# EAGLE design garbage2_routed (EAGLE 5.06)
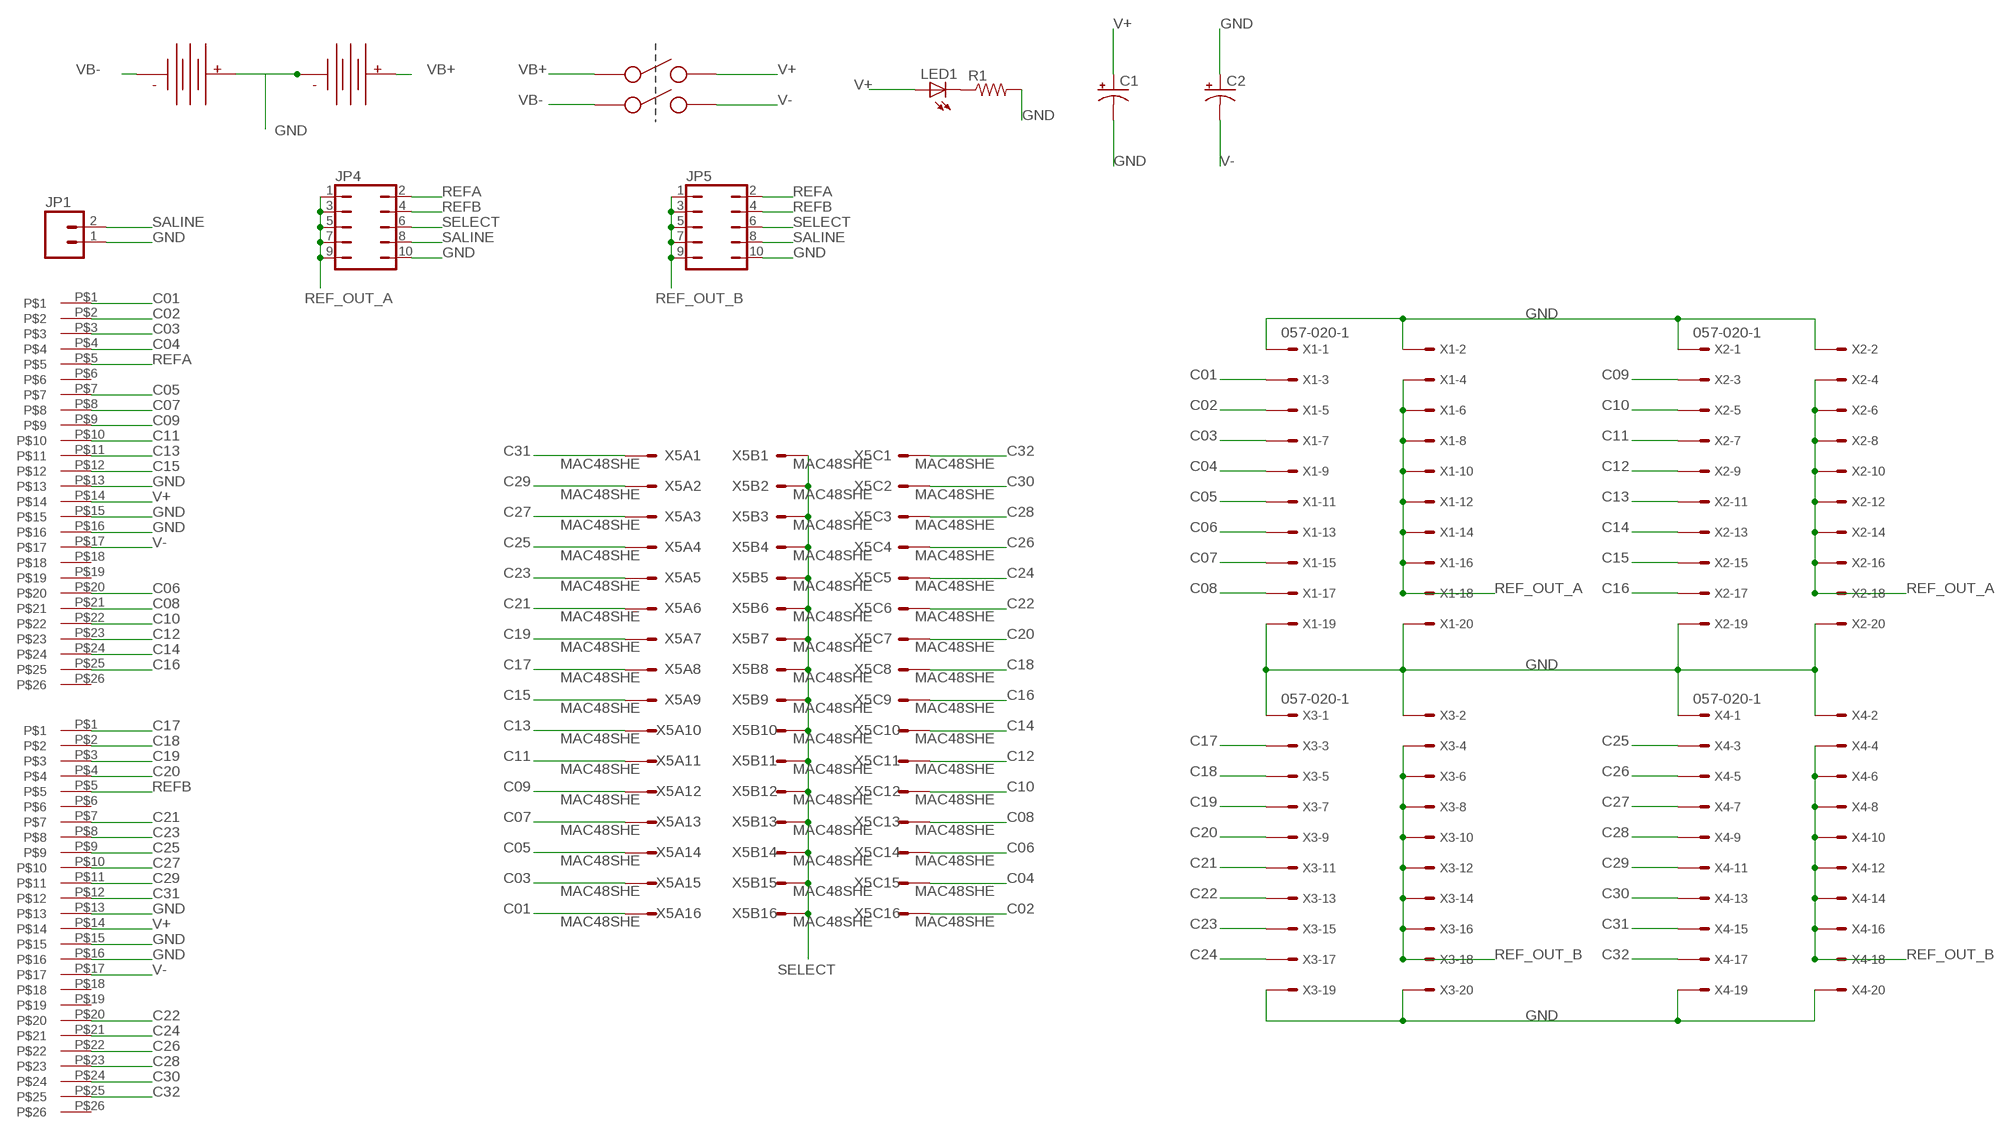
[diagram p0: schematic, sheet 1]

## Parts
BANKA  MINI-DB26TYCO1761028-1  [MINI-DB26]
C1  CPOL-USE2.5-6  [E2,5-6]
C2  CPOL-USE2.5-6  [E2,5-6]
JP1  M02LOCK  [1X02_LOCK]
JP4  JP5Q  [JP5Q]
JP5  JP5Q  [JP5Q]
LED1  LED5MM  [LED5MM]
R1  R-US_0207/10  [0207/10]
U$1  AA-BAT-BHAA-3BHAA-3  [AA-BAT-BHAA-3]
U$2  AA-BAT-BHAA-3BHAA-3  [AA-BAT-BHAA-3]
U$3  MINI-DB26TYCO1761028-1  [MINI-DB26]
U$5  SWITCH-DPST-S201031MS02QDPST  [SWITCH-DPST-S201031MS02Q]
X1  057-020-1  [057-020-1]
X2  057-020-1  [057-020-1]
X3  057-020-1  [057-020-1]
X4  057-020-1  [057-020-1]
X5  MAC48SHE  [MAC48SH]

## Nets
C01: BANKA.P$1 X1.3 X5.A16
C02: BANKA.P$2 X1.5 X5.C16
C03: BANKA.P$3 X1.7 X5.A15
C04: BANKA.P$4 X1.9 X5.C15
C05: BANKA.P$7 X1.11 X5.A14
C06: BANKA.P$20 X1.13 X5.C14
C07: BANKA.P$8 X1.15 X5.A13
C08: BANKA.P$21 X1.17 X5.C13
C09: BANKA.P$9 X2.3 X5.A12
C10: BANKA.P$22 X2.5 X5.C12
C11: BANKA.P$10 X2.7 X5.A11
C12: BANKA.P$23 X2.9 X5.C11
C13: BANKA.P$11 X2.11 X5.A10
C14: BANKA.P$24 X2.13 X5.C10
C15: BANKA.P$12 X2.15 X5.A9
C16: BANKA.P$25 X2.17 X5.C9
C17: U$3.P$1 X3.3 X5.A8
C18: U$3.P$2 X3.5 X5.C8
C19: U$3.P$3 X3.7 X5.A7
C20: U$3.P$4 X3.9 X5.C7
C21: U$3.P$7 X3.11 X5.A6
C22: U$3.P$20 X3.13 X5.C6
C23: U$3.P$8 X3.15 X5.A5
C24: U$3.P$21 X3.17 X5.C5
C25: U$3.P$9 X4.3 X5.A4
C26: U$3.P$22 X4.5 X5.C4
C27: U$3.P$10 X4.7 X5.A3
C28: U$3.P$23 X4.9 X5.C3
C29: U$3.P$11 X4.11 X5.A2
C30: U$3.P$24 X4.13 X5.C2
C31: U$3.P$12 X4.15 X5.A1
C32: U$3.P$25 X4.17 X5.C1
GND: BANKA.P$13 BANKA.P$15 BANKA.P$16 C1.- C2.+ JP1.1 JP4.10 JP5.10 R1.2 U$1.POS U$2.NEG U$3.P$13 U$3.P$15 U$3.P$16 X1.1 X1.2 X1.19 X1.20 X2.1 X2.2 X2.19 X2.20 X3.1 X3.2 X3.19 X3.20 X4.1 X4.2 X4.19 X4.20
N$1: LED1.K(C) R1.1
REF_OUT_A: JP4.1 JP4.3 JP4.5 JP4.7 JP4.9 X1.4 X1.6 X1.8 X1.10 X1.12 X1.14 X1.16 X1.18 X2.4 X2.6 X2.8 X2.10 X2.12 X2.14 X2.16 X2.18
REF_OUT_B: JP5.1 JP5.3 JP5.5 JP5.7 JP5.9 X3.4 X3.6 X3.8 X3.10 X3.12 X3.14 X3.16 X3.18 X4.4 X4.6 X4.8 X4.10 X4.12 X4.14 X4.16 X4.18
REFA: BANKA.P$5 JP4.2 JP5.2
REFB: JP4.4 JP5.4 U$3.P$5
SALINE: JP1.2 JP4.8 JP5.8
SELECT: JP4.6 JP5.6 X5.B1 X5.B2 X5.B3 X5.B4 X5.B5 X5.B6 X5.B7 X5.B8 X5.B9 X5.B10 X5.B11 X5.B12 X5.B13 X5.B14 X5.B15 X5.B16
V+: BANKA.P$14 C1.+ LED1.A U$3.P$14 U$5.PIN2
V-: BANKA.P$17 C2.- U$3.P$17 U$5.PIN5
VB+: U$2.POS U$5.PIN1
VB-: U$1.NEG U$5.PIN4
Unconnected: BANKA.P$6 BANKA.P$18 BANKA.P$19 BANKA.P$26 U$3.P$6 U$3.P$18 U$3.P$19 U$3.P$26

## Library data of the parts
BANKA U$3 = coxlab:MINI-DB26
C1 C2 = resistor:CPOL-US: POLARIZED CAPACITOR, American symbol
JP1 = SparkFun:M02: Header 2 Standard 2-pin 0.1" header. Use with straight break away headers (SKU : PRT-00116), right angle break away headers (PRT-00553), swiss pins (PRT-00743), machine pins (PRT-00117), and female headers (PRT-00115). Molex polarized connector foot print use with SKU : PRT-08233 with associated crimp pins and housings.
JP4 JP5 = jumper:JP5Q: JUMPER
LED1 = led:LED: LED OSRAM: - CHIPLED LG R971, LG N971, LY N971, LG Q971, LY Q971, LO R971, LY R971 LH N974, LH R974 LS Q976, LO Q976, LY Q976 LO Q996 - Hyper CHIPLED LW Q18S LB Q993, LB Q99A, LB R99A - SideLED LS A670, LO A670, LY A670, LG A670, LP A670 LB A673, LV A673, LT A673, LW A673 LH A674 LY A675 LS A676, LA A676, LO A676, LY A676, LW A676 LS A679, LY A679, LG A679 - Hyper Micro SIDELED® LS Y876, LA Y876, LO Y876, LY Y876 LT Y87S - SmartLED LW L88C, LW L88S LB L89C, LB L89S, LG L890 LS L89K, LO L89K, LY L89K LS L896, LA L896, LO L896, LY L896 - TOPLED LS T670, LO T670, LY T670, LG T670, LP T670 LSG T670, LSP T670, LSY T670, LOP T670, LYG T670 LG T671, LOG T671, LSG T671 LB T673, LV T673, LT T673, LW T673 LH T674 LS T676, LA T676, LO T676, LY T676, LB T676, LH T676, LSB T676, LW T676 LB T67C, LV T67C, LT T67C, LS T67K, LO T67K, LY T67K, LW E67C LS E67B, LA E67B, LO E67B, LY E67B, LB E67C, LV E67C, LT E67C LW T67C LS T679, LY T679, LG T679 LS T770, LO T770, LY T770, LG T770, LP T770 LB T773, LV T773, LT T773, LW T773 LH T774 LS E675, LA E675, LY E675, LS T675 LS T776, LA T776, LO T776, LY T776, LB T776 LHGB T686 LT T68C, LB T68C - Hyper Mini TOPLED® LB M676 - Mini TOPLED Santana® LG M470 LS M47K, LO M47K, LY M47K Source: http://www.osram.convergy.de LUXEON: - LUMILED® LXK2-PW12-R00, LXK2-PW12-S00, LXK2-PW14-U00, LXK2-PW14-V00 LXK2-PM12-R00, LXK2-PM12-S00, LXK2-PM14-U00 LXK2-PE12-Q00, LXK2-PE12-R00, LXK2-PE12-S00, LXK2-PE14-T00, LXK2-PE14-U00 LXK2-PB12-K00, LXK2-PB12-L00, LXK2-PB12-M00, LXK2-PB14-N00, LXK2-PB14-P00, LXK2-PB14-Q00 LXK2-PR12-L00, LXK2-PR12-M00, LXK2-PR14-Q00, LXK2-PR14-R00 LXK2-PD12-Q00, LXK2-PD12-R00, LXK2-PD12-S00 LXK2-PH12-R00, LXK2-PH12-S00 LXK2-PL12-P00, LXK2-PL12-Q00, LXK2-PL12-R00 Source: www.luxeon.com KINGBRIGHT: KA-3528ASYC Source: www.kingbright.com
R1 = resistor:R-US_: RESISTOR, American symbol
U$1 U$2 = coxlab:AA-BAT-BHAA-3: PCB mount AA battery holder
U$5 = coxlab:SWITCH-DPST-S201031MS02Q
X1-X4 = con-panduit:057-020-: CONNECTOR 20-pin series 057 contact pc board low profile headers
X5 = con-vg:MAC48SHE: CONNECTOR male, 48 pins, single, type C/2, rows ABC, grid 2.54 mm

## Board
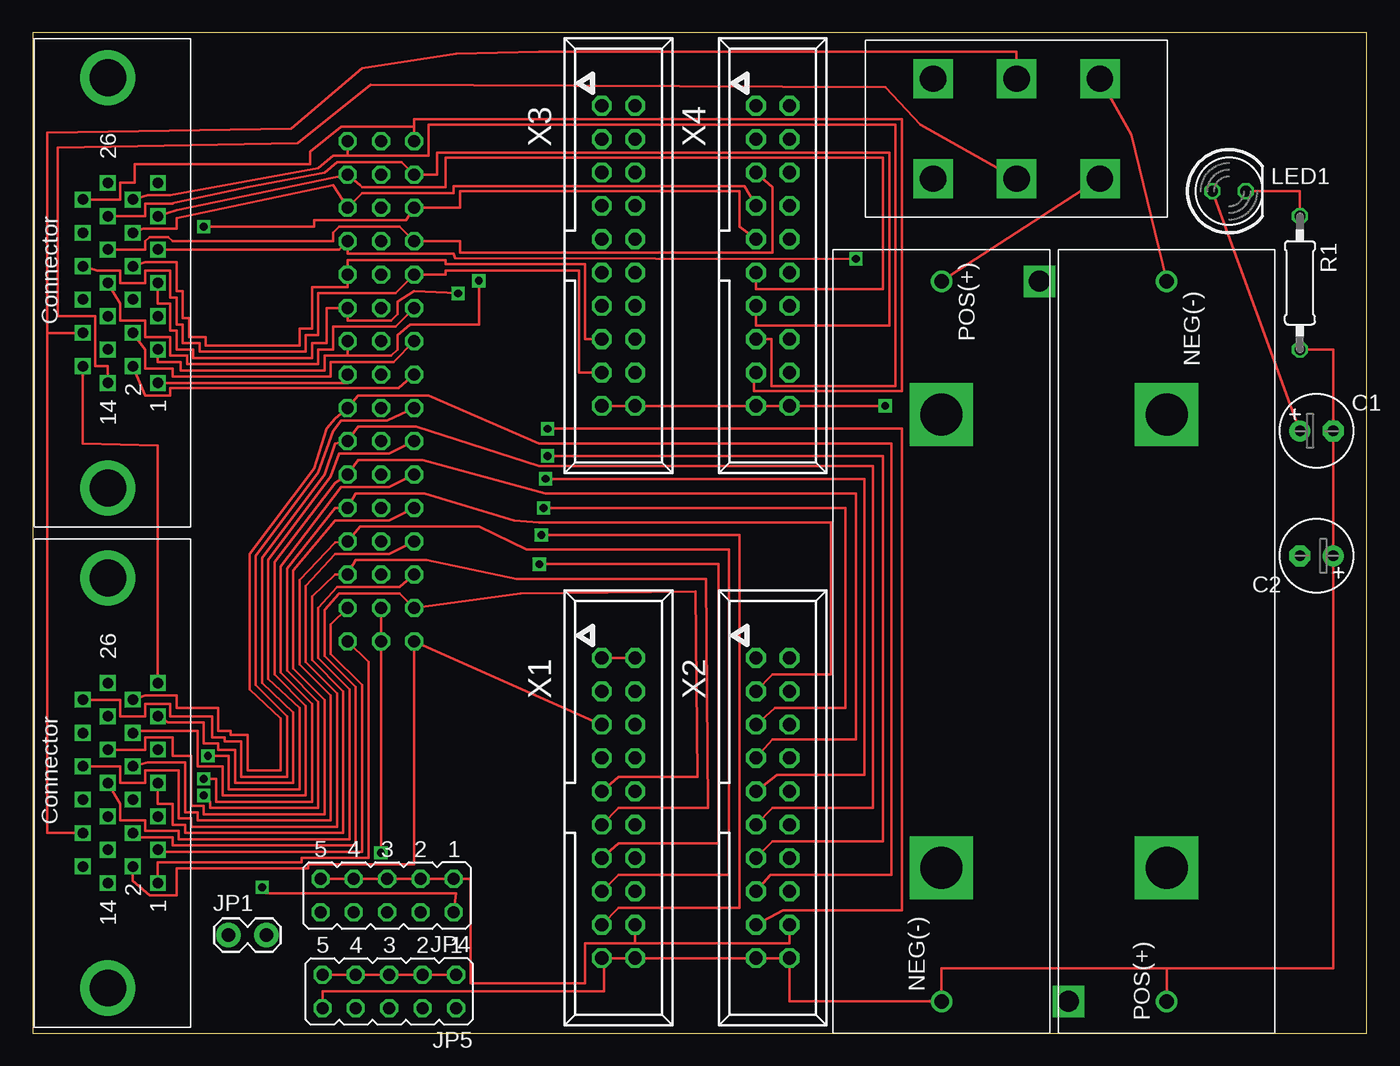
[diagram p1: board, top side]
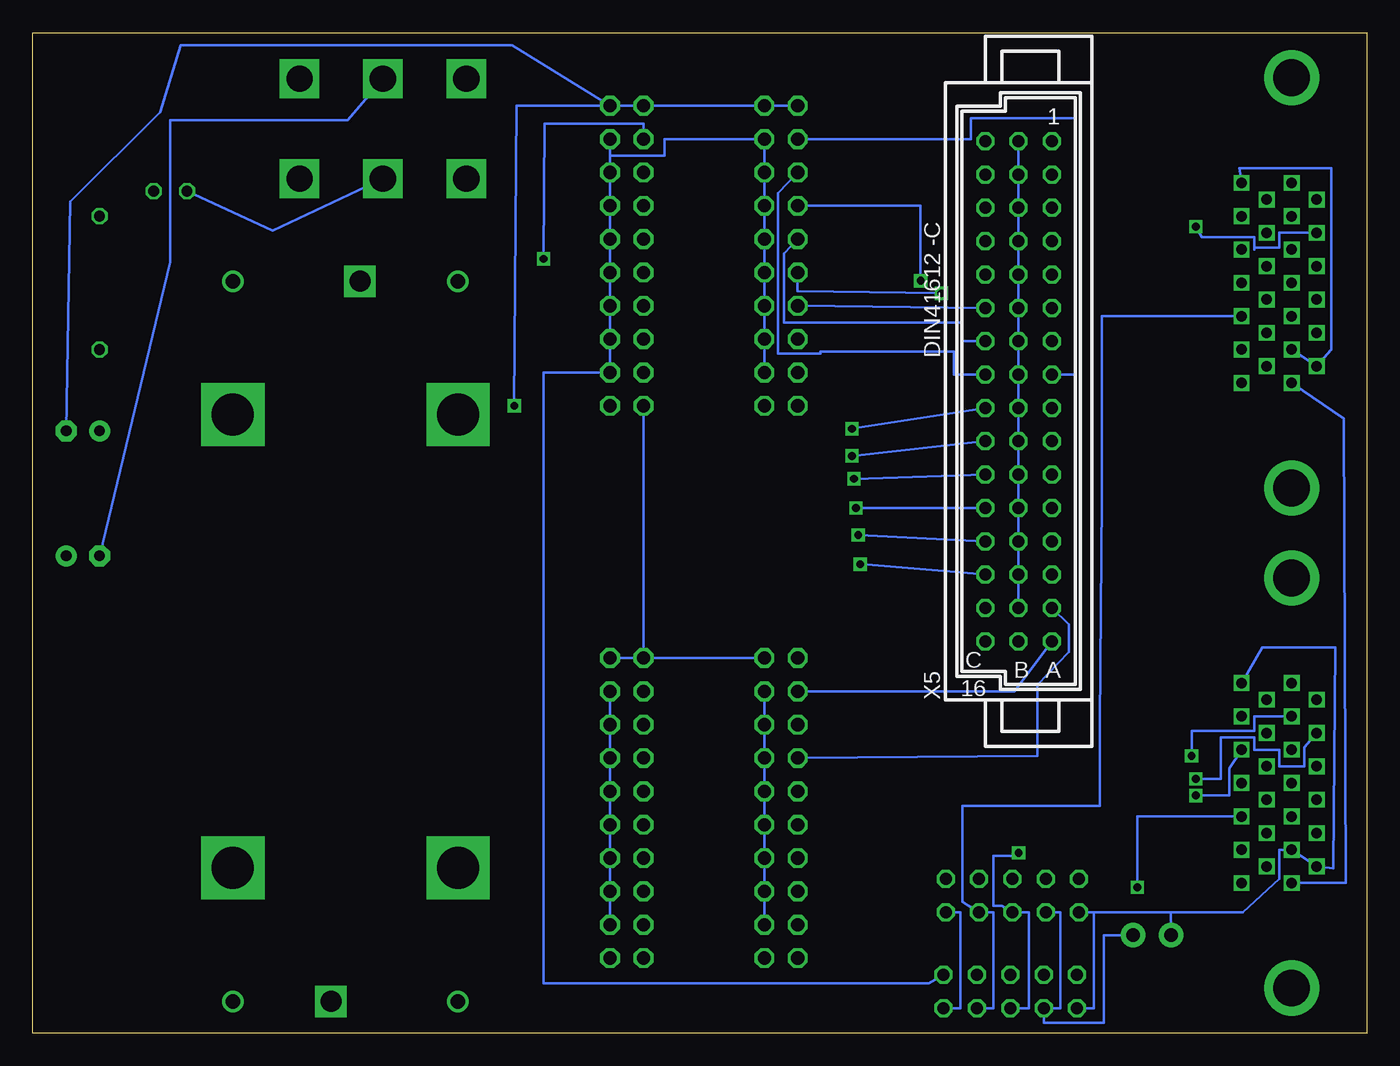
[diagram p2: board, bottom side, seen from below]

Size 101.6 x 76.2 mm. Coordinates in mm from the lower left corner, seen from the top.
Outline: 0,0 101.6,0 101.6,76.2 0,76.2 0,0
Copper layers (1*16): Top 0.0178mm / dielectric 1.4986mm / Bottom 0.0178mm
Design rules "SSC-EAGLE-2Lyr_v1.0.0.3": minimum track width 6mil, minimum drill 14mil, track to track 6mil, track to pad 6mil, pad to pad 6mil, via to via 6mil, smd to smd 6mil, copper to edge 20mil, drill to drill 16mil, minimum pad ring 8mil, minimum via ring 8mil, stop-mask expansion 3mil, vias tented up to drill 0mil, thermal gap 10mil

### Footprints (pad centres in the part's own frame; a part is rotated, then mirrored left to right if it is on the bottom)
MINI-DB26 = drill 0.8 square: P$1 7.62,3.81; P$2 6.35,1.905; P$3 5.08,3.81; P$4 3.81,1.905; P$5 2.54,3.81; P$6 1.27,1.905; P$7 0,3.81; P$8 -1.27,1.905; P$9 -2.54,3.81; P$10 -3.81,1.905; P$11 -5.08,3.81; P$12 -6.35,1.905; P$13 -7.62,3.81; P$14 7.62,0; P$15 6.35,-1.905; P$16 5.08,0; P$17 3.81,-1.905; P$18 2.54,0; P$19 1.27,-1.905; P$20 0,0; P$21 -1.27,-1.905; P$22 -2.54,0; P$23 -3.81,-1.905; P$24 -5.08,0; P$25 -6.35,-1.905; P$26 -7.62,0 | drill 2.8 round: P$27 15.621,0; P$28 -15.621,0
E2,5-6 = drill 0.813 pad 1.6 round: + -1.27,0 | drill 0.813 pad 1.6 octagon: - 1.27,0
1X02_LOCK = drill 1.016 pad 1.88 round: 1 -0.178,0; 2 2.718,0
JP5Q = drill 0.914 octagon: 1 -5.08,-1.27; 2 -5.08,1.27; 3 -2.54,-1.27; 4 -2.54,1.27; 5 0,-1.27; 6 0,1.27; 7 2.54,-1.27; 8 2.54,1.27; 9 5.08,-1.27; 10 5.08,1.27
LED5MM = drill 0.813 octagon: A -1.27,0; K 1.27,0
0207/10 = drill 0.813 octagon: 1 -5.08,0; 2 5.08,0
AA-BAT-BHAA-3 = drill 1.1 round: NEG -27.432,0; POS 27.432,0 | drill 1.6 square: P$3 27.432,-7.468 | drill 3.2 square: P$4 17.272,0; P$5 -17.272,0
SWITCH-DPST-S201031MS02Q = drill 2 square: PIN1 3.81,6.35; PIN2 3.81,0; PIN3 3.81,-6.35; PIN4 -3.81,6.35; PIN5 -3.81,0; PIN6 -3.81,-6.35
057-020-1 = drill 1 octagon: 1 -11.43,-1.27; 2 -11.43,1.27; 3 -8.89,-1.27; 4 -8.89,1.27; 5 -6.35,-1.27; 6 -6.35,1.27; 7 -3.81,-1.27; 8 -3.81,1.27; 9 -1.27,-1.27; 10 -1.27,1.27; 11 1.27,-1.27; 12 1.27,1.27; 13 3.81,-1.27; 14 3.81,1.27; 15 6.35,-1.27; 16 6.35,1.27; 17 8.89,-1.27; 18 8.89,1.27; 19 11.43,-1.27; 20 11.43,1.27
MAC48SH = drill 0.914 octagon: A1 2.54,19.05; A2 2.54,16.51; A3 2.54,13.97; A4 2.54,11.43; A5 2.54,8.89; A6 2.54,6.35; A7 2.54,3.81; A8 2.54,1.27; A9 2.54,-1.27; A10 2.54,-3.81; A11 2.54,-6.35; A12 2.54,-8.89; A13 2.54,-11.43; A14 2.54,-13.97; A15 2.54,-16.51; A16 2.54,-19.05; B1 0,19.05; B2 0,16.51; B3 0,13.97; B4 0,11.43; B5 0,8.89; B6 0,6.35; B7 0,3.81; B8 0,1.27; B9 0,-1.27; B10 0,-3.81; B11 0,-6.35; B12 0,-8.89; B13 0,-11.43; B14 0,-13.97; B15 0,-16.51; B16 0,-19.05; C1 -2.54,19.05; C2 -2.54,16.51; C3 -2.54,13.97; C4 -2.54,11.43; C5 -2.54,8.89; C6 -2.54,6.35; C7 -2.54,3.81; C8 -2.54,1.27; C9 -2.54,-1.27; C10 -2.54,-3.81; C11 -2.54,-6.35; C12 -2.54,-8.89; C13 -2.54,-11.43; C14 -2.54,-13.97; C15 -2.54,-16.51; C16 -2.54,-19.05

### Placement (x,y rotation side)
BANKA  5.71,19.05 270 top
C1  97.79,45.88 0 top
C2  97.79,36.35 180 top
JP1  15.08,7.46 0 top
JP4  26.99,10.48 180 top
JP5  27.15,3.17 180 top
LED1  91.12,64.14 0 top
R1  96.52,57.15 270 top
U$1  86.36,29.84 270 top
U$2  69.22,29.84 90 top
U$3  5.71,57.15 270 top
U$5  74.93,68.9 270 top
X1  44.61,17.14 270 top
X2  56.36,17.14 270 top
X3  44.61,59.21 270 top
X4  56.36,59.21 270 top
X5  26.51,48.9 0 bottom

### Tracks (layer width: path | path; a pad name or v marks a point on that pad's centre or on a via)
C01
  Top 0.203: BANKA.P$1 9.53,13.02 20.48,13.02 20.48,13.34 25.56,13.34 25.56,28.26 X5.A16
  Bottom 0.203: X1.3 26.83,26.04 X5.A16
C02
  Top 0.203: BANKA.P$2 7.62,11.59 8.89,10.48 10.95,10.48 10.95,12.54 20.95,12.54 20.95,12.86 29.05,12.86 X5.C16 X1.5
C03
  Top 0.203: 25.08,13.97 25.08,14.29 | 25.08,13.97 25.08,26.51 22.7,28.89 22.7,31.11 X5.A15 | 25.08,13.97 25.08,13.81 9.53,13.81 BANKA.P$3
  Bottom 0.203: X5.A15 22.7,31.11 22.7,29.05 25.08,26.51 25.08,21.11 X1.7
C04
  Top 0.203: X5.C15 27.94,33.5 23.34,33.5 22.23,32.23 22.23,28.73 24.61,26.35 24.61,14.29 10.64,14.29 10.64,14.92 8.26,14.92 BANKA.P$4 | X5.C15 | X1.9 44.61,19.53 50.64,19.53 50.48,33.66 37.15,33.5 X5.C15
C05
  Top 0.203: BANKA.P$7 9.53,17.46 10.64,17.46 10.64,15.88 11.59,15.88 11.59,15.24 23.65,15.24 23.65,26.04 21.27,28.42 21.27,33.26 23.02,34.92 X5.A14 24.61,36.04 30,36.04 36.83,34.61 51.28,34.61 51.44,17.14 44.61,17.14 X1.11
C06  (via drill 0.6)
  Top 0.203: X5.C14 27.94,33.97 23.18,33.97 21.75,32.38 21.75,28.57 24.13,26.19 24.13,14.76 11.11,14.76 11.11,15.4 8.57,15.4 8.57,16.19 6.67,16.19 6.67,17.46 BANKA.P$20 | X1.13 44.61,14.45 52.23,14.45 52.23,35.72 v38.58,35.72
  Bottom 0.203: v38.58,35.72 X5.C14
C07
  Top 0.203: 23.02,37.39 | BANKA.P$8 8.73,20.64 11.59,20.64 11.59,16.83 12.54,16.83 12.54,16.19 22.7,16.19 22.7,25.72 20.32,28.1 20.32,34.53 23.02,37.39 | 23.02,37.39 X5.A13 24.92,38.58 33.97,38.58 37.62,36.83 53.02,36.83 53.02,12.06 44.61,12.06 X1.15
C08  (via drill 0.6)
  Top 0.203: BANKA.P$21 6.67,20.32 6.67,19.05 8.57,19.05 8.57,20 11.11,20 11.11,16.35 12.06,16.35 12.06,15.72 23.18,15.72 23.18,25.88 20.8,28.26 20.8,34.05 23.02,36.51 27.15,36.51 X5.C13 | X1.17 44.61,9.53 53.82,9.53 53.82,37.94 v38.73,37.94
  Bottom 0.203: v38.73,37.94 X5.C13
C09  (via drill 0.6 pad 0.25)
  Top 0.203: v13.02,18.1 13.49,17.62 13.49,17.14 21.75,17.14 21.75,25.24 19.37,27.62 19.37,35.4 23.02,40.01 X5.A12 24.61,41.12 29.84,41.12 36.67,39.05 38.58,38.89 60.8,38.89 60.8,27.3 56.36,27.3 X2.3
  Bottom 0.203: v13.02,18.1 10.48,18.1 10.48,20.16 BANKA.P$9
C10  (via drill 0.6)
  Top 0.203: BANKA.P$22 8.57,21.59 8.57,22.54 10.64,22.54 10.64,21.11 12.06,21.11 12.06,17.3 13.02,17.3 13.02,16.67 22.23,16.67 22.23,25.4 19.84,27.78 19.84,35.24 23.02,39.05 27.15,39.05 X5.C12 | X2.5 56.52,24.77 61.91,24.77 61.91,40.01 v38.89,40.01
  Bottom 0.203: v38.89,40.01 X5.C12
C11
  Top 0.203: BANKA.P$10 8.1,23.02 12.54,23.02 12.54,20.32 14.45,20.32 14.45,18.1 20.8,18.1 20.8,24.92 18.41,27.3 18.41,35.88 23.02,41.91 X5.A11 24.77,43.66 29.69,43.66 39.05,41.12 62.71,41.12 62.71,22.38 56.36,22.38 X2.7
C12  (via drill 0.6, 0.6 pad 0.25)
  Top 0.203: v13.02,19.37 13.97,19.37 13.97,17.62 21.27,17.62 21.27,25.08 18.89,27.46 18.89,35.56 23.5,41.59 27.15,41.59 X5.C11 | X2.9 56.67,19.68 63.34,19.68 63.34,42.23 v39.05,42.23
  Bottom 0.203: v13.02,19.37 11.11,19.37 11.11,22.54 8.57,22.54 8.57,21.59 6.67,21.59 6.67,20.32 4.76,20.32 4.76,21.75 BANKA.P$23 | v39.05,42.23 X5.C11
C13
  Top 0.203: BANKA.P$11 10.32,23.65 13.02,23.65 13.02,22.07 14.13,22.07 14.13,21.59 15.4,21.59 15.4,19.05 19.84,19.05 19.84,24.45 17.46,26.67 17.46,36.2 22.23,42.55 23.02,44.93 X5.A10 24.77,46.2 29.21,46.2 38.58,43.18 63.98,43.18 63.98,17.14 56.36,17.14 X2.11
C14  (via drill 0.6, 0.6 pad 0.25)
  Top 0.203: v13.34,21.11 14.92,21.11 14.92,18.57 20.32,18.57 20.32,24.77 17.94,26.99 17.94,36.04 22.7,42.39 23.34,44.13 27.15,44.13 X5.C10 | X2.13 56.36,14.61 64.77,14.61 64.77,43.97 v39.21,43.97
  Bottom 0.203: v13.34,21.11 13.34,23.02 8.57,23.02 8.57,24.13 BANKA.P$24 | X5.C10 v39.21,43.97
C15
  Top 0.203: BANKA.P$12 8.57,25.72 10.95,25.72 10.95,24.77 14.13,24.77 14.13,23.02 15.08,23.02 15.08,22.7 16.35,22.7 16.35,20 18.89,20 18.89,23.97 16.51,26.19 16.51,36.51 21.43,43.02 22.38,46.04 23.02,46.83 X5.A9 24.77,48.58 30.16,48.58 38.58,44.93 65.41,44.93 65.41,12.06 56.2,12.06 X2.15
C16  (via drill 0.6)
  Top 0.203: 22.86,45.88 | BANKA.P$25 6.67,25.4 6.67,24.13 8.57,24.13 8.57,25.08 10.48,25.08 10.48,24.13 13.65,24.13 13.65,22.54 14.61,22.54 14.61,22.23 15.88,22.23 15.88,19.53 19.37,19.53 19.37,24.13 16.99,26.51 16.99,36.35 21.75,42.7 22.86,45.88 | X5.C9 26.99,46.67 23.5,46.67 22.86,45.88 | X2.17 57.15,9.37 66.2,9.37 66.2,46.04 v39.21,46.04
  Bottom 0.203: X5.C9 v39.21,46.04
C17
  Top 0.203: U$3.P$1 23.97,49.53 X5.A8
  Bottom 0.203: X3.3 30.16,68.1 30.16,69.69 22.23,69.69 22.23,50.16 X5.A8
C18
  Top 0.203: X5.C8 27.86,49.13 10.48,49.13 10.48,48.58 8.57,48.58 U$3.P$2
  Bottom 0.203: X5.C8 31.43,50.16 31.43,51.91 41.59,51.91 41.59,51.75 44.85,51.75 44.85,63.98 X3.5
C19  (via drill 0.6)
  Top 0.203: 23.97,51.59 22.23,51.59 22.23,50.48 11.27,50.48 11.27,51.12 9.53,51.12 U$3.P$3 | 23.97,51.59 X5.A7 | 23.97,51.59 27.3,51.59 27.78,52.07 27.78,53.18 28.73,53.98 33.97,53.98 v33.97,57.31
  Bottom 0.203: v33.97,57.31 33.97,63.02 X3.7
C20
  Top 0.203: X5.C7 27.46,51.12 22.7,51.12 22.7,50.01 10.64,50.01 10.64,50.64 8.57,50.64 8.57,52.07 U$3.P$4
  Bottom 0.203: X5.C7 30.8,52.7 30.8,54.13 42.39,54.13 42.7,54.13 44.37,54.13 44.37,59.37 X3.9
C21  (via drill 0.6)
  Top 0.203: U$3.P$7 9.53,55.56 10.48,55.56 10.48,53.5 10.95,53.5 10.95,52.07 12.22,52.07 12.22,51.44 21.27,51.44 21.27,52.55 22.38,52.55 22.38,55.24 X5.A6 23.97,54.29 27.3,54.29 27.78,54.77 27.78,55.72 29.05,56.52 v32.38,56.36
  Bottom 0.203: v32.38,56.36 43.34,56.52 X3.11
C22
  Top 0.203: X5.C6 27.62,53.82 22.86,53.82 22.86,52.07 21.75,52.07 21.75,50.96 11.75,50.96 11.75,51.59 10.48,51.59 10.48,53.02 8.57,53.02 8.57,54.29 6.67,54.29 6.67,55.56 U$3.P$20
  Bottom 0.203: X5.C6 X3.13
C23
  Top 0.203: U$3.P$8 8.57,58.74 10.95,58.74 10.95,56.52 11.43,56.52 11.43,54.45 11.91,54.45 11.91,53.02 13.18,53.02 13.18,52.39 20.32,52.39 20.32,53.66 21.27,53.66 21.27,56.83 23.97,56.83 X5.A5 23.97,58.9 31.43,58.9 31.43,58.58 42.07,58.58 42.07,52.86 X3.15
C24
  Top 0.203: U$3.P$21 4.92,58.1 6.67,58.1 6.67,57.15 8.57,57.15 8.57,58.1 10.48,58.1 10.48,56.04 10.95,56.04 10.95,53.98 11.43,53.98 11.43,52.55 12.7,52.55 12.7,51.91 20.8,51.91 20.8,53.18 21.75,53.18 21.75,56.36 27.62,56.36 X5.C5 31.43,57.78 31.43,58.1 41.59,58.1 41.59,50.32 X3.17
C25  (via drill 0.6)
  Top 0.203: U$3.P$9 23.34,59.69 X5.A4 23.97,59.37 32.07,59.37 32.15,59.05 v62.71,58.98
  Bottom 0.203: v62.71,58.98 62.63,69.29 55.09,69.29 X4.3
C26
  Top 0.203: U$3.P$22 8.57,59.69 8.57,60.33 8.89,60.64 10.32,60.64 10.64,60.33 22.86,60.33 22.86,60.96 23.34,61.44 27.94,61.44 X5.C4 32.54,60.33 32.54,59.45 56.36,59.45 56.36,64.45 X4.5
C27
  Top 0.203: U$3.P$10 8.41,61.28 10.95,61.28 10.95,62.07 22.86,64.61 X5.A3 25.08,63.98 32.07,63.98 32.07,64.53 54.21,64.53 X4.7
C28  (via drill 0.6)
  Top 0.203: v13.02,61.44 21.43,61.44 21.43,61.91 28.42,61.91 X5.C3 32.54,62.87 32.54,64.14 53.82,64.14 53.82,61.44 X4.9
  Bottom 0.203: U$3.P$23 6.67,60.96 6.67,59.85 8.57,59.85 | 8.57,59.85 8.57,59.69 | 8.57,59.85 8.57,60.64 12.54,60.64 v13.02,61.44
C29
  Top 0.203: U$3.P$11 10.95,62.71 X5.A2 24.92,64.61 25.08,64.45 31.43,64.45 31.43,66.67 64.77,66.67 64.77,56.67 55.09,56.67 X4.11
C30
  Top 0.203: 10.48,63.18 16.35,64.45 22.23,65.56 23.18,66.36 28.1,66.36 X5.C2 30.8,65.41 30.8,67.07 65.25,67.07 65.25,53.9 55.09,53.9 X4.13 | 10.48,63.18 8.57,63.18 8.57,62.23 U$3.P$24 | 10.48,63.18 10.64,63.18
C31
  Top 0.203: 23.97,66.83 X5.A1 23.97,66.83 | 23.97,66.83 22.86,66.83 21.75,65.88 10.48,63.82 8.73,63.82 U$3.P$12 | 23.97,66.83 30.16,66.83 30.16,69.22 65.72,69.22 65.72,49.29 56.28,49.29 56.28,52.86 X4.15
C32
  Top 0.203: U$3.P$25 6.67,63.5 6.67,64.77 7.78,64.77 7.78,66.2 21.11,66.2 21.11,67.15 23.5,69.06 29.05,69.06 X5.C1 29.05,69.61 66.2,69.61 66.2,48.9 54.93,48.9 54.93,50.32 X4.17
GND  (via drill 0.6)
  Top 0.203: JP5.10 22.07,3.17 43.5,3.17 43.5,5.71 X1.19 X1.20 X2.19 X2.20 57.63,2.41 U$2.NEG 69.22,4.92 86.36,4.92 | 86.36,4.92 U$1.POS | 86.36,4.92 99.06,4.92 C2.+ C1.- 99.06,52.07 R1.2 | X3.19 X3.20 X4.19 X4.20 v64.93,47.78 | X1.2 X1.1 | U$3.P$15 3.81,44.93 9.53,44.77 BANKA.P$13
  Bottom 0.203: 20.8,9.21 JP4.10 | 20.8,9.21 20.8,1.91 JP5.10 | JP5.10 | 14.9,9.21 JP1.1 | 14.9,9.21 20.8,9.21 | 14.9,9.21 9.45,9.21 6.67,11.75 6.67,13.97 BANKA.P$16 BANKA.P$15 2.54,12.54 2.38,29.37 7.94,29.37 BANKA.P$13 | X4.2 65.09,75.25 90.33,75.25 91.92,70.17 98.74,63.34 C1.- | X4.2 X4.1 X3.2 X3.1 | v64.93,47.78 64.77,70.64 X4.2 | X2.1 X2.2 | X4.19 X2.1 | X2.1 X1.2 | U$3.P$16 U$3.P$15 2.7,52.07 2.7,65.88 9.68,65.88 U$3.P$13
N$1
  Top 0.203: R1.1 96.52,64.14 LED1.K
REF_OUT_A
  Top 0.203: JP4.9 JP4.7 JP4.5 JP4.3 JP4.1 33.34,11.75 33.34,3.81 42.07,3.81 42.07,6.83 45.88,6.83 | 45.88,6.83 X1.18 | X2.18 57.63,6.83 45.88,6.83
  Bottom 0.203: X2.4 X2.6 X2.8 X2.10 X2.12 X2.14 X2.16 X2.18 | X1.4 X1.6 X1.8 X1.10 X1.12 X1.14 X1.16 X1.18
REF_OUT_B
  Top 0.203: JP5.9 JP5.7 25.24,4.45 JP5.5 JP5.3 JP5.1
  Bottom 0.203: JP5.1 33.34,3.81 62.71,3.81 62.71,50.32 X4.18 X4.16 X4.14 X4.12 X4.10 X4.8 X4.6 57.63,66.83 | 57.63,66.83 X4.4 | 57.63,66.83 53.5,66.83 53.5,68.1 X3.4 X3.6 X3.8 X3.10 X3.12 X3.14 X3.16 X3.18
REFA  (via drill 0.6)
  Top 0.203: v17.46,11.11 17.78,10.64 32.23,10.64 JP4.2
  Bottom 0.203: JP4.2 30.96,9.21 30.96,1.91 JP5.2 | JP5.2 | BANKA.P$5 17.46,16.51 v17.46,11.11
REFB
  Bottom 0.203: JP5.4 28.42,1.91 28.42,9.21 JP4.4 30.8,10 30.8,17.3 20.32,17.3 20.32,23.65 20.16,40.64 20.16,54.61 U$3.P$5 | JP5.4
SALINE
  Bottom 0.203: JP4.8 23.34,9.21 23.34,1.91 JP5.8 | JP5.8 | JP5.8 24.61,0.79 20,0.79 20,7.46 JP1.2 | JP5.8
SELECT  (via drill 0.6 pad 0.25)
  Top 0.203: X5.B16 | v26.51,13.73 X5.B16 | X5.B16 X5.B15
  Bottom 0.203: JP5.6 25.72,1.91 25.72,9.21 JP4.6 27.78,9.68 28.42,9.68 28.42,13.49 26.51,13.49 v26.51,13.73 | X5.B15 X5.B14 X5.B13 X5.B12 X5.B11 X5.B10 X5.B9 X5.B8 X5.B7 X5.B6 X5.B5 X5.B4 X5.B3 X5.B2 X5.B1
V+
  Top 0.203: LED1.A C1.+ | U$3.P$14 5.71,50.8 4.76,50.8 4.76,54.61 1.91,54.61 1.91,67.47 20.16,67.79 25.72,72.23 64.93,72.07 67.63,69.22 U$5.PIN2
  Bottom 0.203: LED1.A 83.34,61.12 U$5.PIN2 | U$3.P$14 1.75,46.83 1.59,11.43 BANKA.P$14
V-
  Top 0.203: U$5.PIN5 74.93,74.77 38.58,74.77 32.23,74.61 25.08,73.5 19.68,68.9 1.11,68.58 1.11,53.34 | 1.11,53.34 U$3.P$17 | BANKA.P$17 1.11,15.24 1.11,53.34
  Bottom 0.203: C2.- 91.12,58.74 91.12,69.53 77.63,69.53 U$5.PIN5
VB+
  Top 0.203: U$2.POS U$5.PIN1
VB-
  Top 0.203: U$1.NEG 83.66,68.42 U$5.PIN4